# Altium project SnippetsLED.PrjPCB
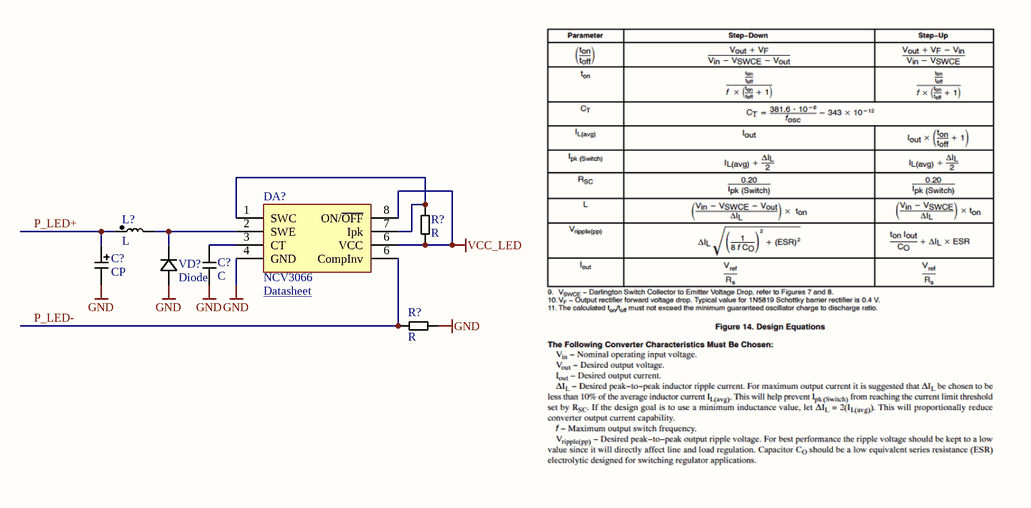
[diagram p0: NCV3066_simple.SchDoc]
1 sheet, 7 parts. Net scope: global (net labels, ports and power ports of the same name join across sheets).

## Sheet NCV3066_simple.SchDoc
size A4

### Parts
(Parts that share a designator on the sheet are numbered #1, #2 ... from top to bottom, then left to right.)
C?#1  CP  [C_EL_4]
C?#2  C  [C0603]
DA?  NCV3066  [SOIC-8]
L?  L  [SDR0403]
R?#1  R  [R1206]
R?#2  R  [R1206]
VD?  Diode  [SOD-123]

### Nets
GND: C?#1.2 C?#2.2 DA?.4(GND) R?#2.2 VD?.1(K)
VCC_LED: DA?.6(VCC) DA?.8(ON/~{OFF}) R?#1.1
P_LED+: C?#1.1 L?.1
P_LED-: DA?.6(CompInv) R?#2.1
NetC?#2_1: C?#2.1 DA?.3(CT)
NetDA?_1: DA?.1(SWC) DA?.7(Ipk) R?#1.2
NetDA?_2: DA?.2(SWE) L?.2 VD?.2(A)

### Notes on the sheet
- (near DA?) Datasheet <http://z.compel.ru/item-pdf/e795ab81231f081e9751395ac26cf844/ps/ons~ncv3066.pdf>

### Library data of the parts
C?#1 = CP: Capacitor polarized
C?#2 = C: Capacitor
DA? = NCV3066D: ON Semi High power LED driver
L? = L: Inductor
R?#1 R?#2 = R: Resistor
VD? = Diode: SMD diode